# EAGLE design linesensor (EAGLE 9.6.2)
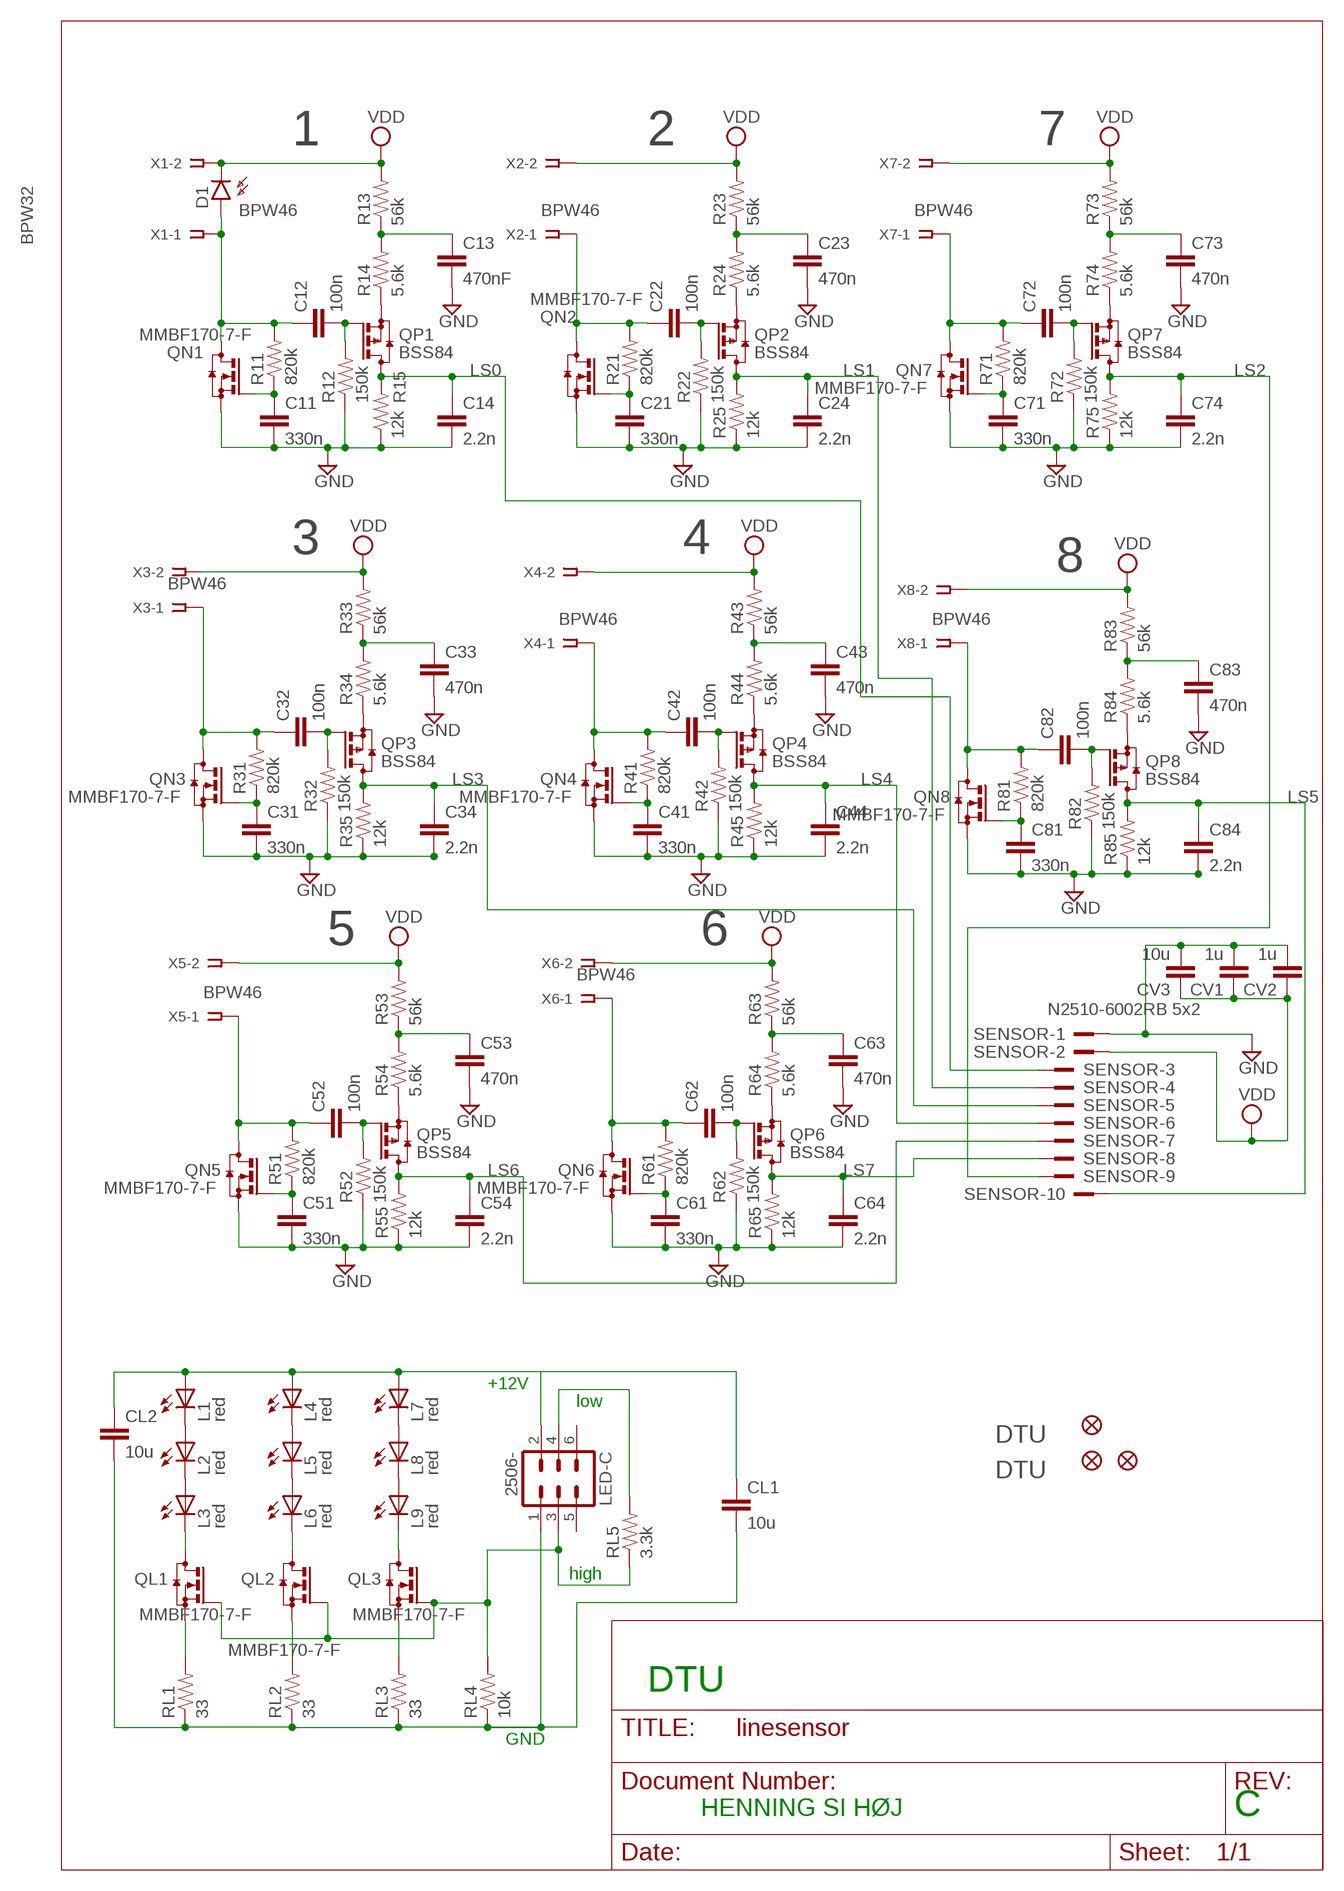
[diagram p0: schematic, sheet 1]

## Parts
C11  330n  CAP0805  [0805]
C12  100n  CAP0805  [0805]
C13  470nF  CAP0805  [0805]
C14  2.2n  CAP0805  [0805]
C21  330n  CAP0805  [0805]
C22  100n  CAP0805  [0805]
C23  470n  CAP0805  [0805]
C24  2.2n  CAP0805  [0805]
C31  330n  CAP0805  [0805]
C32  100n  CAP0805  [0805]
C33  470n  CAP0805  [0805]
C34  2.2n  CAP0805  [0805]
C41  330n  CAP0805  [0805]
C42  100n  CAP0805  [0805]
C43  470n  CAP0805  [0805]
C44  2.2n  CAP0805  [0805]
C51  330n  CAP0805  [0805]
C52  100n  CAP0805  [0805]
C53  470n  CAP0805  [0805]
C54  2.2n  CAP0805  [0805]
C61  330n  CAP0805  [0805]
C62  100n  CAP0805  [0805]
C63  470n  CAP0805  [0805]
C64  2.2n  CAP0805  [0805]
C71  330n  CAP0805  [0805]
C72  100n  CAP0805  [0805]
C73  470n  CAP0805  [0805]
C74  2.2n  CAP0805  [0805]
C81  330n  CAP0805  [0805]
C82  100n  CAP0805  [0805]
C83  470n  CAP0805  [0805]
C84  2.2n  CAP0805  [0805]
CL1  10u  CAP1210  [1210]
CL2  10u  CAP1210  [1210]
CV1  1u  CAP0805  [0805]
CV2  1u  CAP0805  [0805]
CV3  10u  CAP1210  [1210]
D1  BPW32  [BPW32]
FD1  FIDUCIAL1X2  [FIDUCIAL-1X2]
FD2  FIDUCIAL1X2  [FIDUCIAL-1X2]
FD3  FIDUCIAL1X2  [FIDUCIAL-1X2]
L1  red  LED3MM  [LED3MM]
L2  red  LED3MM  [LED3MM]
L3  red  LED3MM  [LED3MM]
L4  red  LED3MM  [LED3MM]
L5  red  LED3MM  [LED3MM]
L6  red  LED3MM  [LED3MM]
L7  red  LED3MM  [LED3MM]
L8  red  LED3MM  [LED3MM]
L9  red  LED3MM  [LED3MM]
LED-C  2506-  [PAK100/2500-06]
QL1  MMBF170-7-F  BSS123  [SOT23]
QL2  MMBF170-7-F  BSS123  [SOT23]
QL3  MMBF170-7-F  BSS123  [SOT23]
QN1  MMBF170-7-F  BSS123  [SOT23]
QN2  MMBF170-7-F  BSS123  [SOT23]
QN3  MMBF170-7-F  BSS123  [SOT23]
QN4  MMBF170-7-F  BSS123  [SOT23]
QN5  MMBF170-7-F  BSS123  [SOT23]
QN6  MMBF170-7-F  BSS123  [SOT23]
QN7  MMBF170-7-F  BSS123  [SOT23]
QN8  MMBF170-7-F  BSS123  [SOT23]
QP1  BSS84  [SOT23]
QP2  BSS84  [SOT23]
QP3  BSS84  [SOT23]
QP4  BSS84  [SOT23]
QP5  BSS84  [SOT23]
QP6  BSS84  [SOT23]
QP7  BSS84  [SOT23]
QP8  BSS84  [SOT23]
R11  820k  RESISTOR0805-RES  [0805]
R12  150k  RESISTOR0805-RES  [0805]
R13  56k  RESISTOR0805-RES  [0805]
R14  5.6k  RESISTOR0805-RES  [0805]
R15  12k  RESISTOR0805-RES  [0805]
R21  820k  RESISTOR0805-RES  [0805]
R22  150k  RESISTOR0805-RES  [0805]
R23  56k  RESISTOR0805-RES  [0805]
R24  5.6k  RESISTOR0805-RES  [0805]
R25  12k  RESISTOR0805-RES  [0805]
R31  820k  RESISTOR0805-RES  [0805]
R32  150k  RESISTOR0805-RES  [0805]
R33  56k  RESISTOR0805-RES  [0805]
R34  5.6k  RESISTOR0805-RES  [0805]
R35  12k  RESISTOR0805-RES  [0805]
R41  820k  RESISTOR0805-RES  [0805]
R42  150k  RESISTOR0805-RES  [0805]
R43  56k  RESISTOR0805-RES  [0805]
R44  5.6k  RESISTOR0805-RES  [0805]
R45  12k  RESISTOR0805-RES  [0805]
R51  820k  RESISTOR0805-RES  [0805]
R52  150k  RESISTOR0805-RES  [0805]
R53  56k  RESISTOR0805-RES  [0805]
R54  5.6k  RESISTOR0805-RES  [0805]
R55  12k  RESISTOR0805-RES  [0805]
R61  820k  RESISTOR0805-RES  [0805]
R62  150k  RESISTOR0805-RES  [0805]
R63  56k  RESISTOR0805-RES  [0805]
R64  5.6k  RESISTOR0805-RES  [0805]
R65  12k  RESISTOR0805-RES  [0805]
R71  820k  RESISTOR0805-RES  [0805]
R72  150k  RESISTOR0805-RES  [0805]
R73  56k  RESISTOR0805-RES  [0805]
R74  5.6k  RESISTOR0805-RES  [0805]
R75  12k  RESISTOR0805-RES  [0805]
R81  820k  RESISTOR0805-RES  [0805]
R82  150k  RESISTOR0805-RES  [0805]
R83  56k  RESISTOR0805-RES  [0805]
R84  5.6k  RESISTOR0805-RES  [0805]
R85  12k  RESISTOR0805-RES  [0805]
RL1  33  RESISTOR0805-RES  [0805]
RL2  33  RESISTOR0805-RES  [0805]
RL3  33  RESISTOR0805-RES  [0805]
RL4  10k  RESISTOR0805-RES  [0805]
RL5  3.3k  RESISTOR0805-RES  [0805]
SENSOR  N2510-6002RB 5x2  2510-  [PAK100/2500-10]
U$1  DTUSMALL-5MM  [DTU-SMALL-5MM]
U$2  DTULARGE  [DTU-LARGE]
X1  BPW46  SSW-102-02-S-S  [SSW-102-02-S-S]
X2  BPW46  SSW-102-02-S-S  [SSW-102-02-S-S]
X3  BPW46  SSW-102-02-S-S  [SSW-102-02-S-S]
X4  BPW46  SSW-102-02-S-S  [SSW-102-02-S-S]
X5  BPW46  SSW-102-02-S-S  [SSW-102-02-S-S]
X6  BPW46  SSW-102-02-S-S  [SSW-102-02-S-S]
X7  BPW46  SSW-102-02-S-S  [SSW-102-02-S-S]
X8  BPW46  SSW-102-02-S-S  [SSW-102-02-S-S]

## Nets
GATE_CTRL: LED-C.3 QL1.1(G) QL2.1(G) QL3.1(G) RL4.2 RL5.1
GND: C11.2 C13.2 C14.2 C21.2 C23.2 C24.2 C31.2 C33.2 C34.2 C41.2 C43.2 C44.2 C51.2 C53.2 C54.2 C61.2 C63.2 C64.2 C71.2 C73.2 C74.2 C81.2 C83.2 C84.2 CV1.2 CV2.2 CV3.2 QN1.2(S) QN2.2(S) QN3.2(S) QN4.2(S) QN5.2(S) QN6.2(S) QN7.2(S) QN8.2(S) R12.1 R15.1 R22.1 R25.1 R32.1 R35.1 R42.1 R45.1 R52.1 R55.1 R62.1 R65.1 R72.1 R75.1 R82.1 R85.1 SENSOR.1
GND2: CL1.2 CL2.2 LED-C.1 RL1.1 RL2.1 RL3.1 RL4.1
LS0: C14.1 QP1.3(D) R15.2 SENSOR.3
LS1: C24.1 QP2.3(D) R25.2 SENSOR.4
LS2: C74.1 QP7.3(D) R75.2 SENSOR.9
LS3: C34.1 QP3.3(D) R35.2 SENSOR.5
LS4: C44.1 QP4.3(D) R45.2 SENSOR.6
LS5: C84.1 QP8.3(D) R85.2 SENSOR.10
LS6: C54.1 QP5.3(D) R55.2 SENSOR.7
LS7: C64.1 QP6.3(D) R65.2 SENSOR.8
N$1: QP1.2(S) R14.1
N$2: QP2.2(S) R24.1
N$3: C11.1 QN1.1(G) R11.1
N$4: C12.1 D1.A QN1.3(D) R11.2 X1.1
N$5: C12.2 QP1.1(G) R12.2
N$6: L1.K(C) L2.A
N$7: C13.1 R13.1 R14.2
N$8: C21.1 QN2.1(G) R21.1
N$9: C22.1 QN2.3(D) R21.2 X2.1
N$10: C22.2 QP2.1(G) R22.2
N$11: L2.K(C) L3.A
N$12: C23.1 R23.1 R24.2
N$14: QP3.2(S) R34.1
N$15: C31.1 QN3.1(G) R31.1
N$16: C32.1 QN3.3(D) R31.2 X3.1
N$17: C32.2 QP3.1(G) R32.2
N$18: L4.K(C) L5.A
N$19: C33.1 R33.1 R34.2
N$20: QP4.2(S) R44.1
N$21: C41.1 QN4.1(G) R41.1
N$22: C42.1 QN4.3(D) R41.2 X4.1
N$23: C42.2 QP4.1(G) R42.2
N$24: L5.K(C) L6.A
N$25: C43.1 R43.1 R44.2
N$26: QP5.2(S) R54.1
N$27: C51.1 QN5.1(G) R51.1
N$28: C52.1 QN5.3(D) R51.2 X5.1
N$29: C52.2 QP5.1(G) R52.2
N$30: L7.K(C) L8.A
N$31: C53.1 R53.1 R54.2
N$32: QP6.2(S) R64.1
N$33: C61.1 QN6.1(G) R61.1
N$34: C62.1 QN6.3(D) R61.2 X6.1
N$35: C62.2 QP6.1(G) R62.2
N$36: L8.K(C) L9.A
N$37: C63.1 R63.1 R64.2
N$38: QP7.2(S) R74.1
N$39: C71.1 QN7.1(G) R71.1
N$40: C72.1 QN7.3(D) R71.2 X7.1
N$41: C72.2 QP7.1(G) R72.2
N$42: L3.K(C) QL1.3(D)
N$43: C73.1 R73.1 R74.2
N$44: QP8.2(S) R84.1
N$45: C81.1 QN8.1(G) R81.1
N$46: C82.1 QN8.3(D) R81.2 X8.1
N$47: C82.2 QP8.1(G) R82.2
N$48: L6.K(C) QL2.3(D)
N$49: C83.1 R83.1 R84.2
N$50: L9.K(C) QL3.3(D)
N$51: QL1.2(S) RL1.2
N$52: QL2.2(S) RL2.2
N$53: QL3.2(S) RL3.2
N$54: LED-C.4 RL5.2
VDD: CV1.1 CV2.1 CV3.1 D1.K(C) R13.2 R23.2 R33.2 R43.2 R53.2 R63.2 R73.2 R83.2 SENSOR.2 X1.2 X2.2 X3.2 X4.2 X5.2 X6.2 X7.2 X8.2
VDD2: CL1.1 CL2.1 L1.A L4.A L7.A LED-C.2
Unconnected: LED-C.5 LED-C.6

## Notes on the sheet
- 1 | 2 | 7
- 3 | 4
- 8
- 5 | 6
- +12V
- low
- high
- DTU
- GND
- HENNING SI HØJ | C

## Library data of the parts
C11-C14 C21-C24 C31-C34 C41-C44 C51-C54 C61-C64 C71-C74 C81-C84 CL1 CL2 CV1-CV3 = SparkFun-Capacitors:CAP: Capacitor Standard 0603 ceramic capacitor, and 0.1" leaded capacitor.
D1 = opto-trans-siemens:BPW32: PHOTO DIODE; OC_FARNELL: unknown; OC_NEWARK: unknown
FD1-FD3 = SparkFun-Aesthetics:FIDUCIAL: Fiducial Alignment Points Various fiducial points for machine vision alignment.
L1-L9 = led:LED: LED OSRAM: - CHIPLED LG R971, LG N971, LY N971, LG Q971, LY Q971, LO R971, LY R971 LH N974, LH R974 LS Q976, LO Q976, LY Q976 LO Q996 - Hyper CHIPLED LW Q18S LB Q993, LB Q99A, LB R99A - SideLED LS A670, LO A670, LY A670, LG A670, LP A670 LB A673, LV A673, LT A673, LW A673 LH A674 LY A675 LS A676, LA A676, LO A676, LY A676, LW A676 LS A679, LY A679, LG A679 - Hyper Micro SIDELED® LS Y876, LA Y876, LO Y876, LY Y876 LT Y87S - SmartLED LW L88C, LW L88S LB L89C, LB L89S, LG L890 LS L89K, LO L89K, LY L89K LS L896, LA L896, LO L896, LY L896 - TOPLED LS T670, LO T670, LY T670, LG T670, LP T670 LSG T670, LSP T670, LSY T670, LOP T670, LYG T670 LG T671, LOG T671, LSG T671 LB T673, LV T673, LT T673, LW T673 LH T674 LS T676, LA T676, LO T676, LY T676, LB T676, LH T676, LSB T676, LW T676 LB T67C, LV T67C, LT T67C, LS T67K, LO T67K, LY T67K, LW E67C LS E67B, LA E67B, LO E67B, LY E67B, LB E67C, LV E67C, LT E67C LW T67C LS T679, LY T679, LG T679 LS T770, LO T770, LY T770, LG T770, LP T770 LB T773, LV T773, LT T773, LW T773 LH T774 LS E675, LA E675, LY E675, LS T675 LS T776, LA T776, LO T776, LY T776, LB T776 LHGB T686 LT T68C, LB T68C - Hyper Mini TOPLED® LB M676 - Mini TOPLED Santana® LG M470 LS M47K, LO M47K, LY M47K Source: http://www.osram.convergy.de LUXEON: - LUMILED® LXK2-PW12-R00, LXK2-PW12-S00, LXK2-PW14-U00, LXK2-PW14-V00 LXK2-PM12-R00, LXK2-PM12-S00, LXK2-PM14-U00 LXK2-PE12-Q00, LXK2-PE12-R00, LXK2-PE12-S00, LXK2-PE14-T00, LXK2-PE14-U00 LXK2-PB12-K00, LXK2-PB12-L00, LXK2-PB12-M00, LXK2-PB14-N00, LXK2-PB14-P00, LXK2-PB14-Q00 LXK2-PR12-L00, LXK2-PR12-M00, LXK2-PR14-Q00, LXK2-PR14-R00 LXK2-PD12-Q00, LXK2-PD12-R00, LXK2-PD12-S00 LXK2-PH12-R00, LXK2-PH12-S00 LXK2-PL12-P00, LXK2-PL12-Q00, LXK2-PL12-R00 Source: www.luxeon.com KINGBRIGHT: KA-3528ASYC Source: www.kingbright.com
LED-C = con-3m:2506-
QL1-QL3 QN1-QN8 = transistor-small-signal:BSS123: N-CHANNEL MOS FET
QP1-QP8 = transistor-small-signal:BSS84: P-CHANNEL MOS FET
R11-R15 R21-R25 R31-R35 R41-R45 R51-R55 R61-R65 R71-R75 R81-R85 RL1-RL5 = SparkFun-Resistors:RESISTOR: Resistor Basic schematic elements and footprints for 0603, 1206, and PTH resistors.
SENSOR = con-3m:2510-: 3M (TM) Pak 100 4-Wall Header Source: 3M; MF: 3M; MPN: 2510-6002UB; OC_FARNELL: 9838244; OC_NEWARK: 46F4725
U$1 U$2 = Logos:DTU
X1-X8 = con-samtec:SSW-102-02-S-S: THROUGH-HOLE .025" SQ POST SOCKET Source: Samtec SSW.pdf; MPN: SSW-102-02-S-S; OC_FARNELL: unknown; OC_NEWARK: 11P9351

## Board
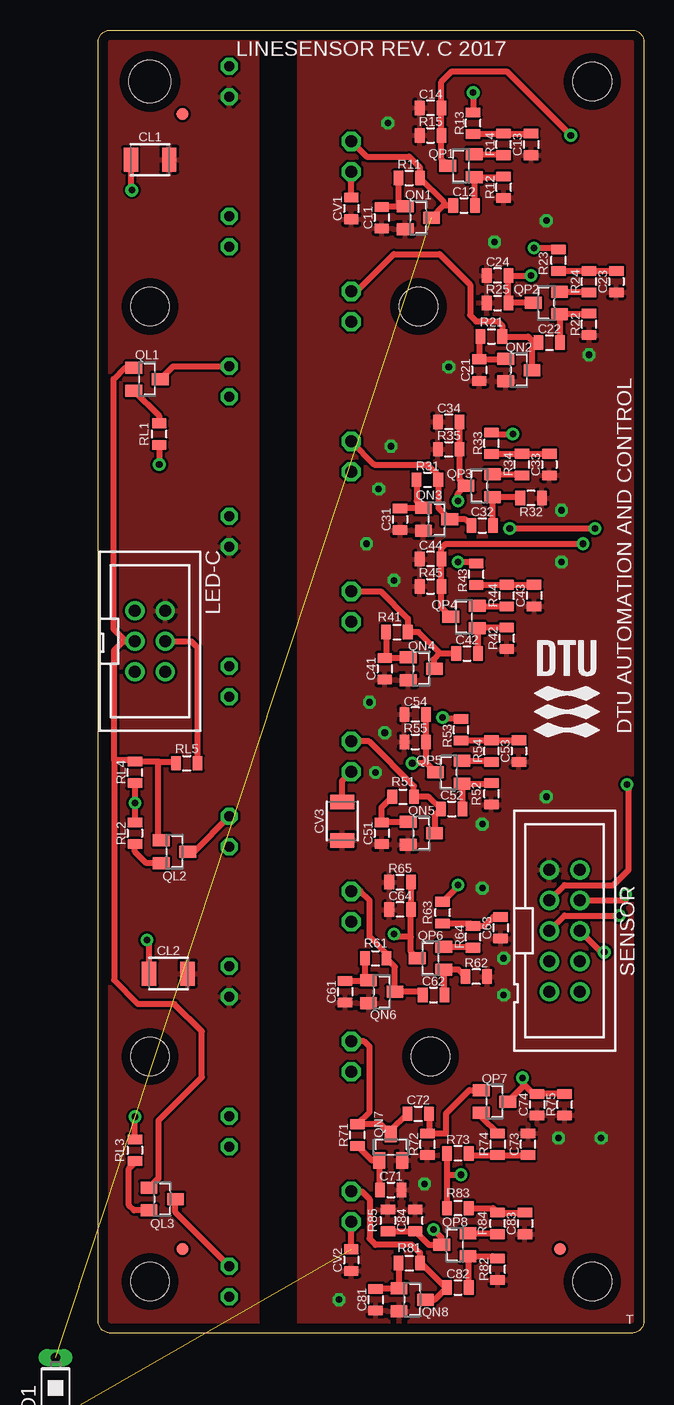
[diagram p1: board, top side]
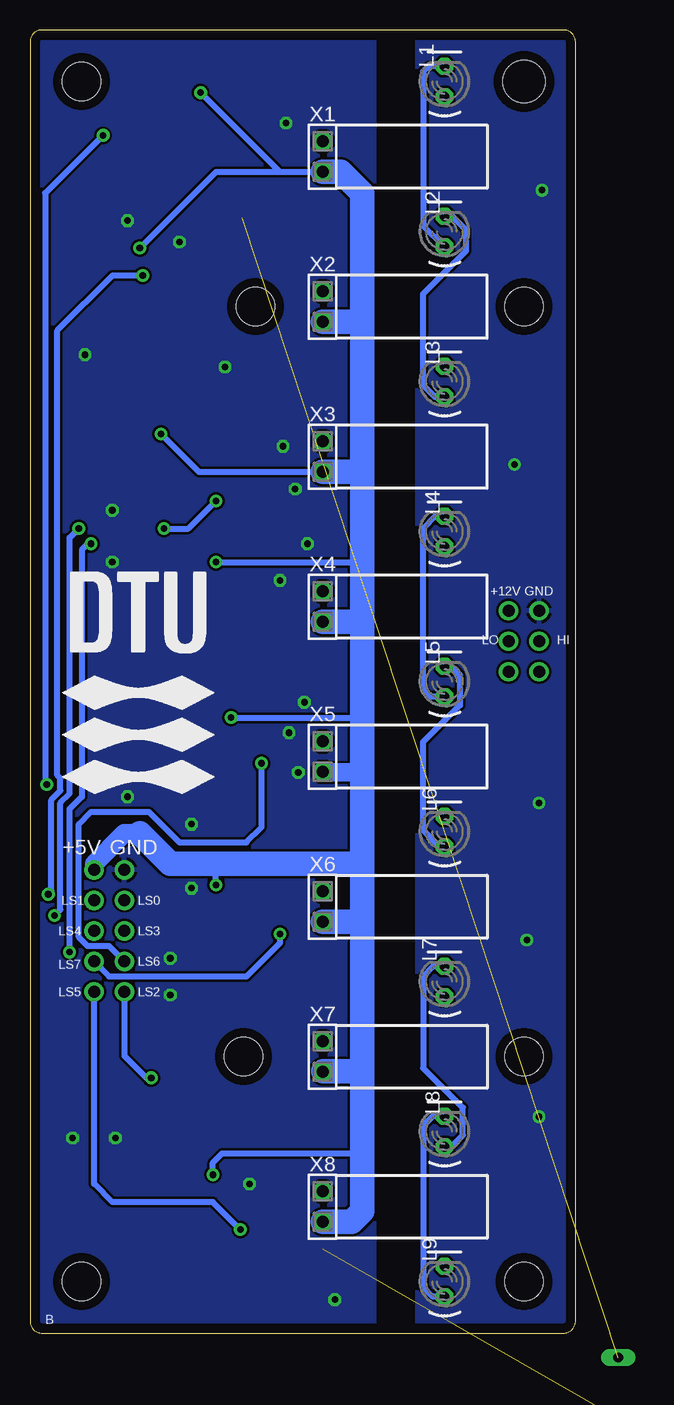
[diagram p2: board, bottom side, seen from below]

Size 45.47 x 108.6 mm. Coordinates in mm from the lower left corner, seen from the top.
Outline: 0,1.02 0,107.58 arc-90 1.02,108.6 44.45,108.6 arc-90 45.47,107.58 45.47,1.02 arc-90 44.45,0 1.02,0 arc-90 0,1.02
Copper layers (1*16): Top 0.035mm / dielectric 1.5mm / Bottom 0.035mm
Design rules "CustomSparkFun2Layer": minimum track width 16mil, minimum drill 20mil, track to track 8mil, track to pad 8mil, pad to pad 8mil, via to via 8mil, smd to smd 8mil, copper to edge 30mil, drill to drill 8mil, minimum pad ring 12mil, minimum via ring 10mil, stop-mask expansion 4mil, vias tented up to drill 25mil, thermal gap 10mil
Holes 3.2 mm at 26.69,85.55 4.3,4.3 4.3,85.55 41.17,104.3 41.17,4.3 4.3,23.05 27.69,23.05
Holes 3.5 mm at 4.3,104.3

### Footprints (pad centres in the part's own frame; a part is rotated, then mirrored left to right if it is on the bottom)
0805 = smd 0.8 x 1.2: 1 -0.9,0; 2 0.9,0
1210 = smd 1.2 x 2: 1 -1.6,0; 2 1.6,0
BPW32 = drill 0.813 long: A 0,2.54; K 0,-2.54
FIDUCIAL-1X2 = smd 1 x 1: 1 0,0
LED3MM = drill 0.813 octagon: A -1.27,0; K 1.27,0
PAK100/2500-06 = drill 1 pad 1.422: 1 -2.54,-1.27; 2 -2.54,1.27; 3 0,-1.27; 4 0,1.27; 5 2.54,-1.27; 6 2.54,1.27
SOT23 = smd 1 x 1.4: 1 -0.95,-1.1; 2 0.95,-1.1; 3 0,1.1
PAK100/2500-10 = drill 1 pad 1.422: 1 -5.08,-1.27; 2 -5.08,1.27; 3 -2.54,-1.27; 4 -2.54,1.27; 5 0,-1.27; 6 0,1.27; 7 2.54,-1.27; 8 2.54,1.27; 9 5.08,-1.27; 10 5.08,1.27
SSW-102-02-S-S = drill 1 pad 1.5 octagon: 1 -1.27,0; 2 1.27,0

### Placement (x,y rotation side)
C11  23.62,92.96 270 top
C12  30.48,93.98 0 top
C13  36.07,99.06 270 top
C14  27.69,102.11 180 top
C21  31.75,80.26 270 top
C22  37.59,82.55 0 top
C23  43.18,87.63 270 top
C24  33.27,88.14 180 top
C31  25.15,67.82 270 top
C32  32,67.31 0 top
C33  37.59,72.39 270 top
C34  29.21,75.95 180 top
C41  23.88,55.37 270 top
C42  30.73,56.64 0 top
C43  36.32,61.47 270 top
C44  27.69,64.52 180 top
C51  23.62,41.66 270 top
C52  29.46,43.69 0 top
C53  35.05,48.51 270 top
C54  26.42,51.56 180 top
C61  20.57,28.45 270 top
C62  27.94,28.19 0 top
C63  33.53,33.78 270 top
C64  25.15,35.31 180 top
C71  24.38,11.94 0 top
C72  26.67,18.29 0 top
C73  35.81,15.75 90 top
C74  36.58,19.05 270 top
C81  23.11,2.79 270 top
C82  29.97,3.81 0 top
C83  35.56,9.14 270 top
C84  26.42,9.4 90 top
CL1  4.32,97.79 180 top
CL2  5.84,29.97 180 top
CV1  21.08,93.73 270 top
CV2  21.08,6.1 270 top
CV3  20.32,42.67 270 top
D1  -3.56,-4.57 0 top  (outside the outline)
FD1  7,7 0 top
FD2  38.47,7 0 top
FD3  7,101.6 0 top
L1  10.92,104.3 90 bottom
L2  10.92,91.8 90 bottom
L3  10.92,79.3 90 bottom
L4  10.92,66.8 90 bottom
L5  10.92,54.3 90 bottom
L6  10.92,41.8 90 bottom
L7  10.92,29.3 90 bottom
L8  10.92,16.8 90 bottom
L9  10.92,4.3 90 bottom
LED-C  4.32,57.66 270 top
QL1  4.06,79.5 270 top
QL2  6.35,40.13 270 top
QL3  5.33,11.18 270 top
QN1  26.67,92.96 270 top
QN2  35.05,80.26 270 top
QN3  28.19,67.82 270 top
QN4  26.92,55.37 270 top
QN5  26.92,41.66 270 top
QN6  23.62,28.45 270 top
QN7  24.38,15.49 0 top
QN8  26.16,2.79 270 top
QP1  30.23,97.28 90 top
QP2  37.34,85.85 90 top
QP3  31.75,70.61 90 top
QP4  30.48,59.69 90 top
QP5  29.21,46.74 90 top
QP6  27.69,31.24 90 top
QP7  33.02,19.3 270 top
QP8  29.72,7.37 90 top
R11  25.91,96.27 0 top
R12  33.78,95.5 90 top
R13  31.24,100.84 90 top
R14  33.78,99.06 90 top
R15  27.69,99.82 0 top
R21  32.77,83.06 0 top
R22  40.89,84.07 90 top
R23  38.35,89.41 90 top
R24  40.89,87.63 90 top
R25  33.27,85.85 0 top
R31  27.43,71.12 0 top
R32  36.07,69.6 180 top
R33  32.77,74.17 90 top
R34  35.31,72.39 90 top
R35  29.21,73.66 0 top
R41  24.89,58.42 0 top
R42  34.04,57.91 90 top
R43  31.5,63.25 90 top
R44  34.04,61.47 90 top
R45  27.69,62.23 0 top
R51  25.4,44.7 0 top
R52  32.77,44.96 90 top
R53  30.23,50.29 90 top
R54  32.77,48.51 90 top
R55  26.42,49.28 0 top
R61  23.11,31.24 0 top
R62  31.5,29.72 180 top
R63  28.7,35.05 90 top
R64  31.24,33.02 90 top
R65  25.15,37.59 0 top
R71  21.59,16.51 90 top
R72  27.43,15.75 90 top
R73  29.97,14.99 180 top
R74  33.27,15.75 270 top
R75  38.86,19.05 90 top
R81  25.91,5.84 0 top
R82  33.27,5.33 90 top
R83  29.97,10.41 180 top
R84  33.27,9.14 90 top
R85  24.13,9.4 270 top
RL1  5.08,74.93 90 top
RL2  3.05,41.66 270 top
RL3  3.05,15.24 270 top
RL4  3.05,46.74 90 top
RL5  7.37,47.5 0 top
SENSOR  38.86,33.53 270 top
U$1  39.12,54.36 0 top
U$2  36.32,55.37 0 bottom
X1  21.08,98.05 270 bottom
X2  21.08,85.55 270 bottom
X3  21.08,73.05 270 bottom
X4  21.08,60.55 270 bottom
X5  21.08,48.05 270 bottom
X6  21.08,35.55 270 bottom
X7  21.08,23.05 270 bottom
X8  21.08,10.55 270 bottom

### Tracks (layer width: path | path; a pad name or v marks a point on that pad's centre or on a via)
GATE_CTRL
  Top 0.508: 2.29,57.66 2.08,57.66 1.32,56.9 1.32,47.75 | 2.29,57.66 1.27,58.67 1.27,79.5 2.22,80.45 QL1.1 | 1.32,47.75 1.32,29.41 3.3,27.43 6.35,27.43 8.64,25.15 8.64,21.34 5.01,17.71 5.01,12.91 QL3.1 | 4.83,47.64 RL4.2 2.93,47.75 1.32,47.75 | 4.83,47.64 6.33,47.64 RL5.1 | LED-C.3 2.29,57.66 | QL2.1 5.01,41.32 5.01,47.64 4.83,47.64
GND  (via drill 0.55)
  other vias: 27.18,12.45 38.35,16.26 41.91,16.26 20.07,2.79 33.78,31.24 33.78,28.19 32,37.08 32,42.42 23.88,50.04 22.61,52.58 24.64,62.74 22.35,65.79 24.38,73.91 23.37,70.36 33.02,90.93 37.34,92.71 29.21,80.52 37.34,44.7 23.11,46.74 38.61,64.26 38.61,68.58 40.89,81.53 24.13,100.84
  pour Bottom: 16.76,110 44.45,110 44.7,0.51 16.76,0.51
  pour Top: 16.76,110 16.76,0.51 44.7,0.51 44.45,110
GND2  (via drill 0.55)
  Top 0.508: RL3.1 v3.05,18.03 | CL2.2 4.24,32.59 v4.06,32.77 | RL2.1 v3.05,44.2 RL4.1 | RL1.1 v5.08,72.39 | CL1.2 2.72,95.33 v2.79,95.25
  pour Bottom: 0.51,110 13.21,110 13.21,0.51 0.51,0.51
LS0  (via drill 0.55)
  Top 0.508: QP1.3 28.59,97.82 R15.2 C14.1 28.59,104.28 29.46,105.16 34.04,105.16 v39.37,99.82 | SENSOR.3 38.87,37.35 42.93,37.35 44.2,38.61 44.2,45.59 v44.07,45.72
  Bottom 0.508: v44.07,45.72 44.2,45.72 44.2,95 v39.37,99.82
LS1  (via drill 0.55)
  Top 0.508: QP2.3 R25.2 C24.1 v36.07,88.14 | SENSOR.4 43.94,36.07 v43.94,36.58
  Bottom 0.508: v43.94,36.58 43.69,36.83 43.69,44.45 42.93,45.21 42.93,46.23 43.18,46.48 43.18,83.57 38.61,88.14 v36.07,88.14
LS2  (via drill 0.55)
  Top 0.508: R75.2 C74.1 36.24,19.95 35.36,20.83 | 35.36,21.05 v35.36,21.28 35.36,20.83 | QP7.3 35.36,20.54 35.36,20.83
  Bottom 0.508: SENSOR.9 37.59,23.11 35.76,21.28 v35.36,21.28
LS3  (via drill 0.55)
  Top 0.508: C34.1 R35.2 30.11,71.15 QP3.3 29.97,69.93 v29.97,69.34 | SENSOR.5 38.86,34.8 v43.43,34.8 | v41.4,67.06 v34.29,67.06
  Bottom 0.508: v43.43,34.8 42.93,35.31 42.93,44.2 42.16,44.96 42.16,66.29 v41.4,67.06 | v34.29,67.06 32.26,67.06 v29.97,69.34
LS4  (via drill 0.55)
  Top 0.508: QP4.3 28.59,60.48 R45.2 C44.1 28.59,65.42 28.96,65.79 v40.39,65.79 | SENSOR.6 41.91,31.75 v42.16,31.75
  Bottom 0.508: 42.16,31.5 v42.16,31.75 42.16,43.69 41.15,44.7 41.15,65.28 40.64,65.79 v40.39,65.79
LS5  (via drill 0.55)
  Top 0.508: R85.2 C84.1 27.55,7.37 QP8.3 28.62,7.96 v27.94,8.64
  Bottom 0.508: v27.94,8.64 30.23,10.92 38.61,10.92 40.13,12.45 SENSOR.10
LS6  (via drill 0.55)
  Top 0.508: 27.32,47.53 QP5.3 | 27.32,47.53 R55.2 C54.1 | v26.16,47.5 26.19,47.53 27.32,47.53
  Bottom 0.508: SENSOR.7 38.87,32.27 40.66,32.27 41.4,33.01 41.4,42.42 40.39,43.43 35.56,43.43 33.02,40.89 27.43,40.89 26.16,42.16 v26.16,47.5
LS7  (via drill 0.55)
  Top 0.508: 26.05,33.02 26.05,31.78 QP6.3 | 26.05,33.02 C64.1 R65.2 | 26.05,33.02 24.89,33.02 v24.64,33.27
  Bottom 0.508: v24.64,33.27 24.64,32.51 27.43,29.72 38.86,29.72 SENSOR.8
N$1
  Top 0.508: QP1.2 33.71,98.23 R14.1
N$2
  Top 0.508: QP2.2 40.82,86.8 R24.1
N$3
  Top 0.508: 25.52,93.86 C11.1 | 25.52,93.86 QN1.1 | R11.1 25.01,94.12 25.52,93.86
N$4  (1 unrouted)
  Top 0.508: 28.79,93.98 QN1.3 | 28.79,93.98 C12.1 | 28.79,93.98 28.79,94.29 R11.2 26.81,97.14 25.91,98.04 22.36,98.04 X1.1
N$5
  Top 0.508: 31.5,96.33 QP1.1 | 31.5,96.33 33.71,96.33 R12.2 | C12.2 31.38,96.22 31.5,96.33
N$6
  Bottom 0.508: L2.A 12.7,92.31 12.7,105.16 12.29,105.57 L1.K
N$7
  Top 0.508: C13.1 R14.2 33.76,99.94 R13.1
N$8
  Top 0.508: R21.1 31.75,82.94 C21.1 33.9,81.16 QN2.1
N$9
  Top 0.508: QN2.3 36.15,82.01 36.51,82.36 | 36.51,82.36 C22.1 | 36.51,82.36 35.81,83.06 R21.2 33.67,83.94 33.27,84.33 31.5,84.33 30.99,84.84 30.99,87.38 28.45,89.92 24.64,89.92 21.54,86.82 X2.1
N$10
  Top 0.508: R22.2 40.82,84.9 QP2.1 38.44,82.6 C22.2
N$11
  Bottom 0.508: L2.K 10.27,93.07 9.14,91.95 9.14,90.17 12.7,86.61 12.7,78.99 11.74,78.03 L3.A 11.63,78.03
N$12
  Top 0.508: C23.1 R24.2 40.87,88.51 R23.1
N$14
  Top 0.508: QP3.2 35.23,71.56 R34.1
N$15
  Top 0.508: R31.1 26.53,69.33 QN3.1 25.2,68.77 C31.1
N$16
  Top 0.508: C32.1 30.6,67.82 QN3.3 28.33,68.78 R31.2 28.33,71.49 27.43,72.39 23.01,72.39 X3.1
N$17
  Top 0.508: R32.2 35.23,69.66 QP3.1 32.85,67.36 C32.2
N$18
  Bottom 0.508: L4.K 11.69,68.07 12.7,67.06 12.7,53.59 12.14,53.03 L5.A
N$19
  Top 0.508: R33.1 35.28,73.27 R34.2 C33.1
N$20
  Top 0.508: QP4.2 31.65,60.57 R44.1
N$21
  Top 0.508: QN4.1 25.77,56.27 C41.1 23.99,56.39 R41.1
N$22
  Top 0.508: 28.45,56.64 C42.1 | 28.45,56.64 27.94,56.13 27.94,55.46 QN4.3 | 28.45,56.64 26.67,58.42 R41.2 25.79,59.55 23.52,61.82 X4.1
N$23
  Top 0.508: R42.2 31.65,58.81 QP4.1 31.63,58.69 C42.2
N$24
  Bottom 0.508: L6.A 11.32,40.53 12.7,41.91 12.7,49.28 9.65,52.32 9.65,54.86 10.36,55.57 L5.K
N$25
  Top 0.508: C43.1 R44.2 31.52,62.37 R43.1
N$26
  Top 0.508: QP5.2 32.69,47.69 R54.1
N$27
  Top 0.508: QN5.1 23.67,42.61 C51.1 23.62,43.83 R51.1
N$28
  Top 0.508: QN5.3 28.02,43.15 C52.1 27.55,44.7 R51.2 26.3,45.58 22.56,49.32 X5.1
N$29
  Top 0.508: R52.2 32.58,45.79 QP5.1 30.36,45.73 C52.2
N$30
  Bottom 0.508: L8.A 10.38,15.53 9.4,16.51 9.4,18.8 12.7,22.1 12.7,29.72 11.85,30.57 L7.K
N$31
  Top 0.508: R54.2 C53.1 | 32.65,49.53 R54.2 | R53.1 30.25,49.41 R54.2
N$32
  Top 0.508: QP6.2 31.17,32.19 R64.1
N$33
  Top 0.508: 22.47,29.35 QN6.1 | 22.47,29.35 C61.1 | R61.1 22.21,29.61 22.47,29.35
N$34
  Top 0.508: C62.1 27.04,28.45 QN6.3 24.72,30.53 R61.2 24.01,31.61 22.61,33.02 22.61,36.07 21.84,36.83 21.09,36.83 X6.1
N$35
  Top 0.508: R62.2 30.02,30.29 QP6.1 28.79,28.39 C62.2
N$36
  Bottom 0.508: L9.A 10.94,3.05 11.94,3.05 12.7,3.81 12.7,17.27 11.9,18.07 L8.K
N$37
  Top 0.508: R63.1 31.01,34.15 R64.2 32.14,33.92 32.9,34.68 C63.1
N$38
  Top 0.508: 33.12,16.65 R74.1 31.92,18 QP7.2
N$39
  Top 0.508: C71.1 23.43,11.99 QN7.1 22.81,14.39 R71.1
N$40
  Top 0.508: C72.1 24.38,16.9 QN7.3 23.57,17.41 R71.2 22.61,18.43 22.61,23.88 22.16,24.32 X7.1
N$41
  Top 0.508: 27.69,16.65 R72.2 | 27.69,16.65 28.99,16.65 28.99,18.32 30.92,20.25 QP7.1 | C72.2 27.57,16.76 27.69,16.65
N$42
  Top 0.508: L3.K 6.23,80.57 QL1.3
N$43
  Top 0.508: C73.1 R74.2 31.01,14.85 R73.1
N$44
  Top 0.508: QP8.2 33.2,8.32 R84.1
N$45
  Top 0.508: C81.1 23.16,3.74 QN8.1 25.06,5.79 R81.1
N$46
  Top 0.508: QN8.3 28.06,2.79 29,3.74 | 29,3.74 C82.1 | X8.1 21.96,11.82 22.61,11.18 22.61,7.87 23.11,7.37 26.16,7.37 26.81,6.72 R81.2 26.9,5.84 29,3.74
N$47
  Top 0.508: C82.2 30.87,6.36 QP8.1 32.84,6.42 R82.2
N$48
  Top 0.508: L6.K 7.98,40.13 QL2.3
N$49
  Top 0.508: C83.1 R84.2 32.9,10.41 R83.1
N$50
  Top 0.508: L9.K 6.42,10.08 6.42,11.18 QL3.3
N$51
  Top 0.508: QL1.2 5.08,76.44 RL1.2
N$52
  Top 0.508: 3.11,40.69 RL2.2 3.05,40.13 4,39.18 QL2.2
N$53
  Top 0.508: RL3.2 3.11,14.27 2.54,13.7 2.54,10.67 2.98,10.23 QL3.2
N$54
  Top 0.508: RL5.2 8.27,57.15 7.76,57.66 LED-C.4
VDD  (via drill 0.55)  (1 unrouted)
  Top 0.508: R83.2 29.07,13.21 | 29.07,13.21 R73.2 | CV2.1 X8.2 | R63.2 29.97,37.22 v29.97,37.34 | R23.2 38.35,90.42 v36.32,90.42 | CV1.1 X1.2 | 29.07,13.21 v30.23,13.21 | v31.24,103.38 R13.2 | CV3.1 20.32,46.02 X5.2 | R53.2 28.82,51.19 v28.7,51.31 | R43.2 31.38,64.26 v29.97,64.26 | R33.2 32.9,74.93 v34.54,74.93
  Bottom 0.508: v29.97,37.34 29.97,39.12 | v30.23,13.21 30.23,14.22 29.46,14.99 17.78,14.99 | 24.64,96.78 X1.2 | 24.64,96.78 v31.24,103.38 | v28.7,51.31 17.78,51.31 | v29.97,64.26 18.03,64.26 17.78,64.01 | v34.54,74.93 31.39,71.78 X3.2 | v36.32,90.42 29.97,96.78 24.64,96.78
  Bottom 1.524: X7.2 21.02,21.84 | X6.2 | X5.2 21.04,46.74 17.78,46.74 | 17.78,59.44 17.94,59.28 | 17.78,84.33 17.83,84.28 | 17.78,71.88 17.88,71.78 | 36.32,41.66 37.59,41.66 40.13,39.12 SENSOR.2
  Bottom 2.032: X8.2 18.66,9.28 17.78,10.16 17.78,14.99 17.78,21.84 | 17.78,34.29 17.78,21.84 | 17.78,39.12 17.78,46.74 17.78,51.31 17.78,59.44 17.78,64.01 17.78,71.88 17.78,84.33 17.78,95 19.56,96.78 X1.2 | 17.78,39.12 17.78,34.29 | 21.02,21.84 17.78,21.84 | X6.2 17.78,34.29 | 17.94,59.28 X4.2 | 17.83,84.28 X2.2 | X3.2 17.88,71.78 | 36.32,41.66 33.78,39.12 29.97,39.12 17.78,39.12
VDD2
  pour Top: 0.51,110 13.21,110 13.21,0.51 0.51,0.51

### Text on the board
tPlace: LINESENSOR REV. C 2017 | DTU AUTOMATION AND CONTROL | T
bPlace: GND | +12V | HI | LO | GND | +5V | LS0 | LS1 | LS3 | LS4 | LS6 | LS7 | LS2 | LS5 | B